# EAGLE schematic interface_board (EAGLE 8.0.0)
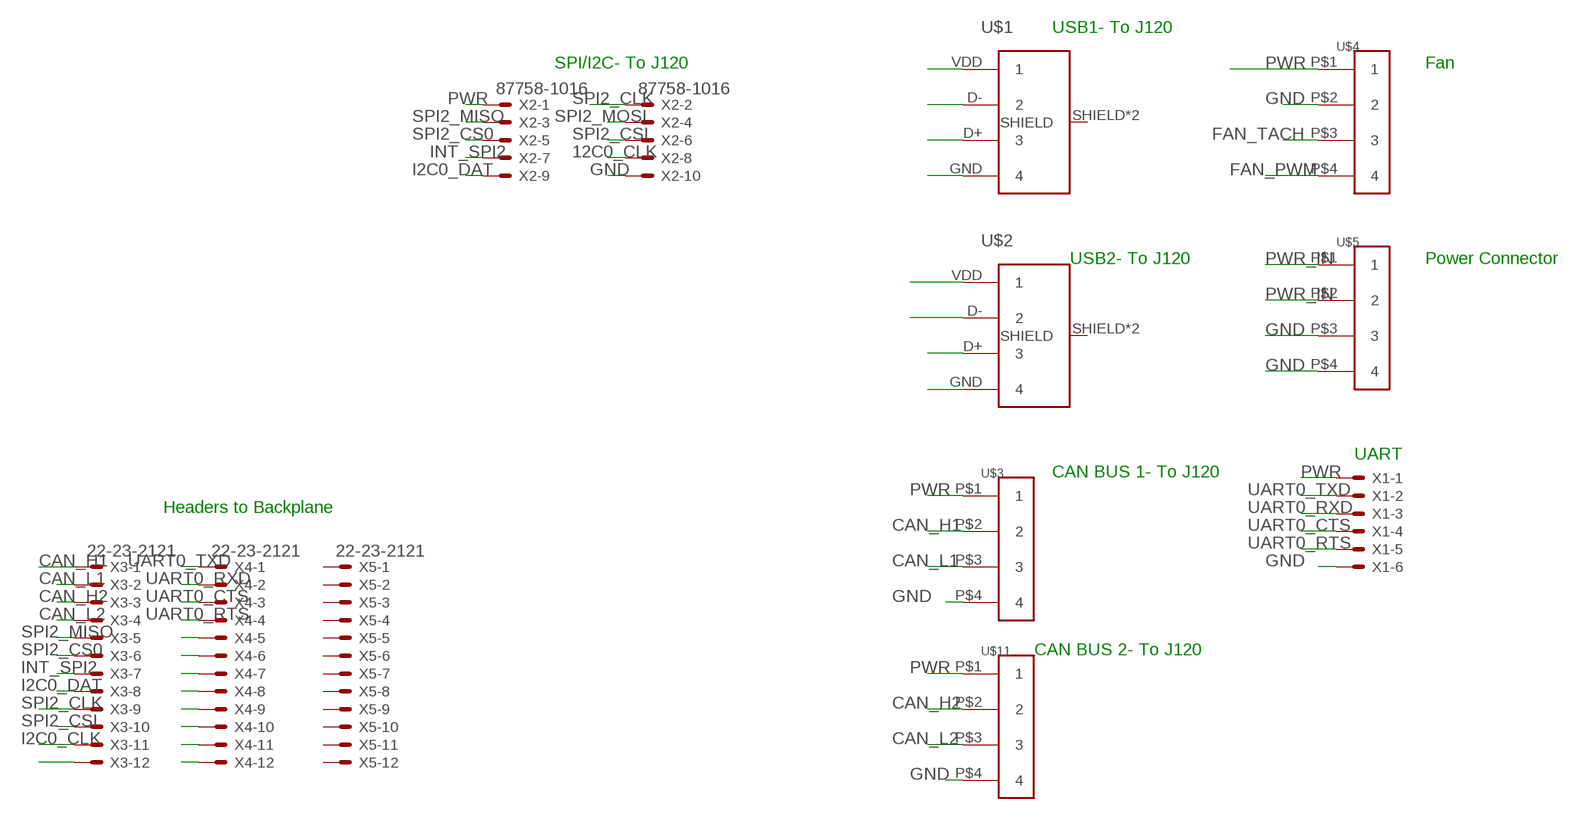
[diagram p0: schematic, sheet 1]

## Parts
U$1  USB_4PIN_VERT  [UE27AE54100]
U$2  USB_4PIN_VERT  [UE27AE54100]
U$3  DF13-4  [DF13-4]
U$4  DF13-4  [DF13-4]
U$5  DF13-4  [DF13-4]
U$11  DF13-4  [DF13-4]
X1  22-23-2061  [22-23-2061]
X2  87758-1016  [87758-1016]
X3  22-23-2121  [22-23-2121]
X4  22-23-2121  [22-23-2121]
X5  22-23-2121  [22-23-2121]

## Nets
12C0_CLK: X2.8
CAN_H1: U$3.P$2 X3.1
CAN_H2: U$11.P$2 X3.3
CAN_L1: U$3.P$3 X3.2
CAN_L2: U$11.P$3 X3.4
FAN_PWM: U$4.P$4
FAN_TACH: U$4.P$3
GND: U$1.GND U$2.GND U$3.P$4 U$4.P$2 U$5.P$3 U$5.P$4 U$11.P$4 X1.6 X2.10
I2C0_CLK: X3.11
I2C0_DAT: X2.9 X3.8
INT_SPI2: X2.7 X3.7
N$1: U$1.VDD
N$2: U$1.D-
N$3: U$1.D+
N$8: X4.5
N$9: X4.6
N$10: X4.7
N$11: X4.8
N$12: X4.9
N$13: X4.10
N$14: X4.11
N$15: X4.12
N$19: X3.12
PWR: U$2.VDD U$3.P$1 U$4.P$1 U$11.P$1 X1.1 X2.1
PWR_IN: U$5.P$1 U$5.P$2
SPI2_CLK: X2.2 X3.9
SPI2_CS0: X2.5 X3.6
SPI2_CSI: X2.6 X3.10
SPI2_MISO: X2.3 X3.5
SPI2_MOSI: X2.4
UART0_CTS: X1.4 X4.3
UART0_RTS: X1.5 X4.4
UART0_RXD: X1.3 X4.2
UART0_TXD: X1.2 X4.1
USB2_D+: U$2.D+
USB2_D-: U$2.D-
Unconnected: U$1.SHIELD U$1.SHIELD1(SHIELD) U$2.SHIELD U$2.SHIELD1(SHIELD) X5.1 X5.2 X5.3 X5.4 X5.5 X5.6 X5.7 X5.8 X5.9 X5.10 X5.11 X5.12

## Notes on the sheet
- USB1- To J120
- SPI/I2C- To J120 | Fan
- USB2- To J120 | Power Connector
- UART
- CAN BUS 1- To J120
- Headers to Backplane
- CAN BUS 2- To J120

## Library data of the parts
U$1 U$2 = connectors:USB_4PIN_VERT: Amphenol USB 4-pin vertical header UE27AE54100 Drawing <https://www.amphenolcanada.com/ProductSearch/drawings/AC/UE27AEX4X0X.pdf>
U$3-U$5 U$11 = connectors:DF13-4: Hirose 4-pin vertical header 1.25mm Pitch Miniature Crimping Connector Digikey Product Page <https://www.digikey.com/product-detail/en/DF13-4P-1.25DSA/H2193-ND/241767>
X1 = con-molex_MOD:22-23-2061: .100" (2.54mm) Center Header - 6 Pin; MF: MOLEX; MPN: 22-23-2061; OC_FARNELL: 1462922; OC_NEWARK: 27C1933
X2 = con-molex_MOD:87758-1016: 10 Pin - 2mm Dual Row Single Wafer, Vertical T/H HDR Source: http://www.molex.com/pdm_docs/sd/877580616_sd.pdf; MF: MOLEX; MPN: 87758-1016; OC_FARNELL: 7472340; OC_NEWARK: 59J1558
X3-X5 = con-molex_MOD:22-23-2121: .100" (2.54mm) Center Header - 12 Pin; MF: MOLEX; MPN: 22-23-2121; OC_FARNELL: 1462935; OC_NEWARK: 56H0456